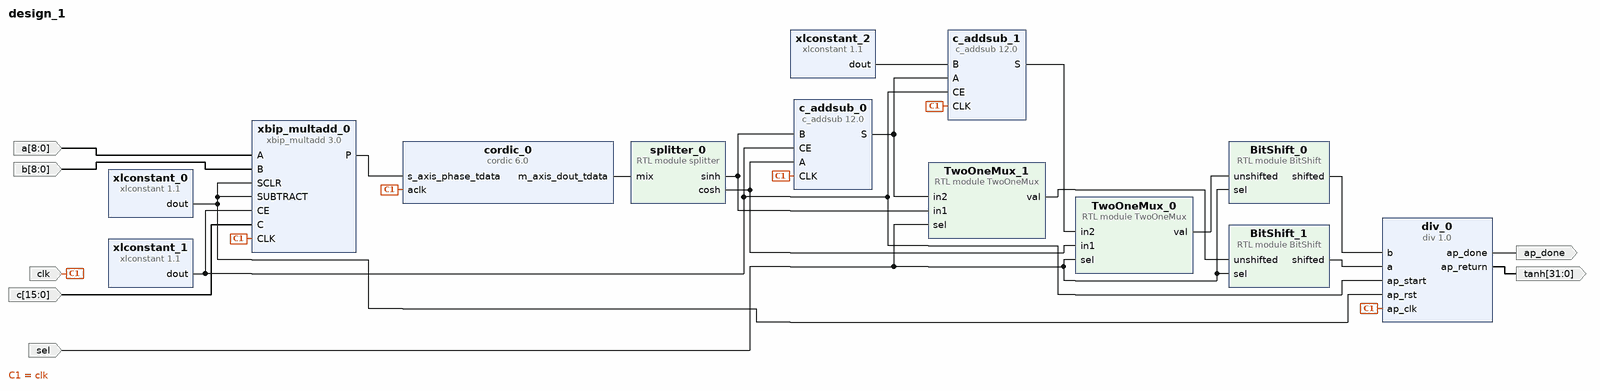
[diagram p0: block diagram of the top level]
# Vivado block design design_1, xc7a35tcpg236-1, Vivado 2022.2
create_bd_design design_1

create_bd_port -dir I clk
create_bd_port -dir I -from 8 -to 0 a
create_bd_port -dir I -from 8 -to 0 b
create_bd_port -dir I -from 15 -to 0 c
create_bd_port -dir I sel
create_bd_port -dir O -from 31 -to 0 tanh
create_bd_port -dir O ap_done

create_bd_cell -type ip -vlnv xilinx.com:ip:xbip_multadd:3.0 xbip_multadd_0
set_property -dict [list \
  CONFIG.c_a_width 9 \
  CONFIG.c_b_width 9 \
  CONFIG.c_c_width 16 \
  CONFIG.c_out_high 15 \
  CONFIG.c_out_low 0 \
] [get_bd_cells xbip_multadd_0]
create_bd_cell -type ip -vlnv xilinx.com:ip:cordic:6.0 cordic_0
set_property -dict [list \
  CONFIG.Coarse_Rotation false \
  CONFIG.Data_Format SignedFraction \
  CONFIG.Functional_Selection Sinh_and_Cosh \
  CONFIG.Input_Width 16 \
  CONFIG.Output_Width 16 \
] [get_bd_cells cordic_0]
create_bd_cell -type ip -vlnv xilinx.com:ip:xlconstant:1.1 xlconstant_0
set_property -dict {CONFIG.CONST_VAL 0} [get_bd_cells xlconstant_0]
create_bd_cell -type ip -vlnv xilinx.com:ip:xlconstant:1.1 xlconstant_1
create_bd_cell -type ip -vlnv xilinx.com:ip:c_addsub:12.0 c_addsub_0
set_property -dict [list \
  CONFIG.A_Type Signed \
  CONFIG.A_Width 16 \
  CONFIG.B_Type Signed \
  CONFIG.B_Value 0000000000000000 \
  CONFIG.B_Width 16 \
  CONFIG.Implementation Fabric \
  CONFIG.Latency 2 \
  CONFIG.Latency_Configuration Automatic \
  CONFIG.Out_Width 16 \
] [get_bd_cells c_addsub_0]
create_bd_cell -type ip -vlnv xilinx.com:ip:c_addsub:12.0 c_addsub_1
set_property -dict [list \
  CONFIG.A_Type Signed \
  CONFIG.A_Width 16 \
  CONFIG.B_Type Signed \
  CONFIG.B_Value 0000000000000000 \
  CONFIG.B_Width 16 \
  CONFIG.Latency 1 \
  CONFIG.Out_Width 16 \
] [get_bd_cells c_addsub_1]
create_bd_cell -type ip -vlnv xilinx.com:ip:xlconstant:1.1 xlconstant_2
set_property -dict {CONFIG.CONST_VAL 16384 CONFIG.CONST_WIDTH 16} [get_bd_cells xlconstant_2]
create_bd_cell -type module -reference TwoOneMux TwoOneMux_0
create_bd_cell -type module -reference TwoOneMux TwoOneMux_1
create_bd_cell -type module -reference splitter splitter_0
create_bd_cell -type ip -vlnv xilinx.com:hls:div:1.0 div_0
create_bd_cell -type module -reference BitShift BitShift_0
create_bd_cell -type module -reference BitShift BitShift_1

# ---- connections ----

connect_bd_net [get_bd_pins BitShift_0/shifted] [get_bd_pins div_0/b]
connect_bd_net [get_bd_pins BitShift_1/shifted] [get_bd_pins div_0/a]
connect_bd_net -net TwoOneMux_0_out [get_bd_pins TwoOneMux_0/val] [get_bd_pins BitShift_0/unshifted]
connect_bd_net [get_bd_pins TwoOneMux_1/val] [get_bd_pins BitShift_1/unshifted]
connect_bd_net [get_bd_ports a] [get_bd_pins xbip_multadd_0/A]
connect_bd_net [get_bd_ports b] [get_bd_pins xbip_multadd_0/B]
connect_bd_net [get_bd_ports c] [get_bd_pins xbip_multadd_0/C]
connect_bd_net [get_bd_pins c_addsub_0/S] [get_bd_pins c_addsub_1/A] [get_bd_pins TwoOneMux_1/in2]
connect_bd_net [get_bd_pins c_addsub_1/S] [get_bd_pins TwoOneMux_0/in2]
connect_bd_net [get_bd_ports clk] \
  [get_bd_pins xbip_multadd_0/CLK] [get_bd_pins cordic_0/aclk] [get_bd_pins c_addsub_0/CLK] [get_bd_pins c_addsub_1/CLK] \
  [get_bd_pins div_0/ap_clk]
connect_bd_net [get_bd_pins cordic_0/m_axis_dout_tdata] [get_bd_pins splitter_0/mix]
connect_bd_net [get_bd_pins div_0/ap_done] [get_bd_ports ap_done]
connect_bd_net [get_bd_pins div_0/ap_return] [get_bd_ports tanh]
connect_bd_net [get_bd_ports sel] \
  [get_bd_pins TwoOneMux_0/sel] [get_bd_pins TwoOneMux_1/sel] [get_bd_pins BitShift_0/sel] [get_bd_pins BitShift_1/sel]
connect_bd_net [get_bd_pins splitter_0/cosh] [get_bd_pins c_addsub_0/A] [get_bd_pins TwoOneMux_0/in1]
connect_bd_net [get_bd_pins splitter_0/sinh] [get_bd_pins c_addsub_0/B] [get_bd_pins TwoOneMux_1/in1]
connect_bd_net [get_bd_pins xbip_multadd_0/P] [get_bd_pins cordic_0/s_axis_phase_tdata]
connect_bd_net [get_bd_pins xlconstant_0/dout] [get_bd_pins xbip_multadd_0/SUBTRACT] [get_bd_pins xbip_multadd_0/SCLR] [get_bd_pins div_0/ap_rst]
connect_bd_net [get_bd_pins xlconstant_1/dout] \
  [get_bd_pins xbip_multadd_0/CE] [get_bd_pins c_addsub_1/CE] [get_bd_pins div_0/ap_start] [get_bd_pins c_addsub_0/CE]
connect_bd_net [get_bd_pins xlconstant_2/dout] [get_bd_pins c_addsub_1/B]

validate_bd_design
save_bd_design
